# Altium project PCB_Project.PrjPcb
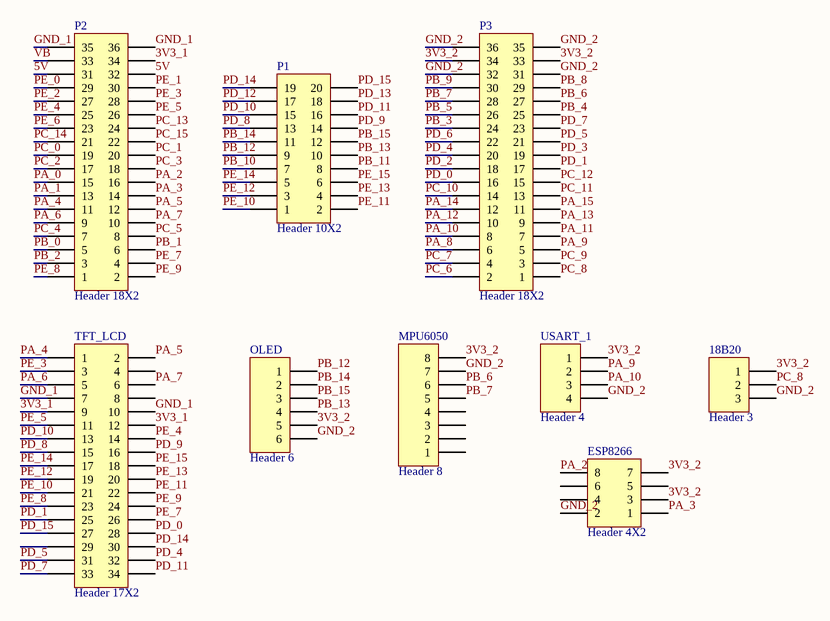
[diagram p0: Sheet1.SchDoc]
1 sheet, 9 parts. Net scope: global (net labels, ports and power ports of the same name join across sheets).
Board file: PCB1.PcbDoc

## Sheet Sheet1.SchDoc
size A3

### Parts
18B20  Header 3  [HDR1X3]
ESP8266  Header 4X2  [HDR2X4]
MPU6050  Header 8  [HDR1X8]
OLED  Header 6  [HDR1X6]
P1  Header 10X2  [HDR2X10]
P2  Header 18X2  [HDR2X18]
P3  Header 18X2  [HDR2X18]
TFT_LCD  Header 17X2  [HDR2X17]
USART_1  Header 4  [HDR1X4]

### Nets
3V3_1: P2.34 TFT_LCD.9 TFT_LCD.12
3V3_2: 18B20.1 ESP8266.3 ESP8266.7 MPU6050.8 OLED.5 P3.33 P3.34 USART_1.1
5V: P2.31 P2.32
GND_1: P2.35 P2.36 TFT_LCD.7 TFT_LCD.10
GND_2: 18B20.3 ESP8266.2 MPU6050.7 OLED.6 P3.31 P3.32 P3.35 P3.36 USART_1.4
PA_0: P2.15
PA_1: P2.13
PA_2: ESP8266.8 P2.16
PA_3: ESP8266.1 P2.14
PA_4: P2.11 TFT_LCD.1
PA_5: P2.12 TFT_LCD.2
PA_6: P2.9 TFT_LCD.5
PA_7: P2.10 TFT_LCD.6
PA_8: P3.6
PA_9: P3.5 USART_1.2
PA_10: P3.8 USART_1.3
PA_11: P3.7
PA_12: P3.10
PA_13: P3.9
PA_14: P3.12
PA_15: P3.11
PB_0: P2.5
PB_1: P2.6
PB_2: P2.3
PB_3: P3.24
PB_4: P3.25
PB_5: P3.26
PB_6: MPU6050.6 P3.27
PB_7: MPU6050.5 P3.28
PB_8: P3.29
PB_9: P3.30
PB_10: P1.7
PB_11: P1.8
PB_12: OLED.1 P1.9
PB_13: OLED.4 P1.10
PB_14: OLED.2 P1.11
PB_15: OLED.3 P1.12
PC_0: P2.19
PC_1: P2.20
PC_2: P2.17
PC_3: P2.18
PC_4: P2.7
PC_5: P2.8
PC_6: P3.2
PC_7: P3.4
PC_8: 18B20.2 P3.1
PC_9: P3.3
PC_10: P3.14
PC_11: P3.13
PC_12: P3.15
PC_13: P2.24
PC_14: P2.21
PC_15: P2.22
PD_0: P3.16 TFT_LCD.28
PD_1: P3.17 TFT_LCD.25
PD_2: P3.18
PD_3: P3.19
PD_4: P3.20 TFT_LCD.32
PD_5: P3.21 TFT_LCD.31
PD_6: P3.22
PD_7: P3.23 TFT_LCD.33
PD_8: P1.13 TFT_LCD.15
PD_9: P1.14 TFT_LCD.16
PD_10: P1.15 TFT_LCD.13
PD_11: P1.16 TFT_LCD.34
PD_12: P1.17
PD_13: P1.18
PD_14: P1.19 TFT_LCD.30
PD_15: P1.20 TFT_LCD.27
PE_0: P2.29
PE_1: P2.30
PE_2: P2.27
PE_3: P2.28 TFT_LCD.3
PE_4: P2.25 TFT_LCD.14
PE_5: P2.26 TFT_LCD.11
PE_6: P2.23
PE_7: P2.4 TFT_LCD.26
PE_8: P2.1 TFT_LCD.23
PE_9: P2.2 TFT_LCD.24
PE_10: P1.1 TFT_LCD.21
PE_11: P1.2 TFT_LCD.22
PE_12: P1.3 TFT_LCD.19
PE_13: P1.4 TFT_LCD.20
PE_14: P1.5 TFT_LCD.17
PE_15: P1.6 TFT_LCD.18
VB: P2.33

Not connected (* = marked no-connect by the designer): ESP8266 4 5 6; MPU6050 1 2 3 4; TFT_LCD 4 8 29

### Library data of the parts
18B20 = Header 3: Header, 3-Pin; LatestRevisionDate: 17-Jul-2002; LatestRevisionNote: Re-released for DXP Platform.; Publisher: Altium Limited
ESP8266 = Header 4X2: Header, 4-Pin, Dual row; LatestRevisionDate: 17-Jul-2002; LatestRevisionNote: Re-released for DXP Platform.; Publisher: Altium Limited
MPU6050 = Header 8: Header, 8-Pin; LatestRevisionDate: 17-Jul-2002; LatestRevisionNote: Re-released for DXP Platform.; Publisher: Altium Limited
OLED = Header 6: Header, 6-Pin; LatestRevisionDate: 17-Jul-2002; LatestRevisionNote: Re-released for DXP Platform.; Publisher: Altium Limited
P1 = Header 10X2: Header, 10-Pin, Dual row; LatestRevisionDate: 17-Jul-2002; LatestRevisionNote: Re-released for DXP Platform.; Publisher: Altium Limited
P2 P3 = Header 18X2: Header, 18-Pin, Dual row; LatestRevisionDate: 17-Jul-2002; LatestRevisionNote: Re-released for DXP Platform.; Publisher: Altium Limited
TFT_LCD = Header 17X2: Header, 17-Pin, Dual row; LatestRevisionDate: 17-Jul-2002; LatestRevisionNote: Re-released for DXP Platform.; Publisher: Altium Limited
USART_1 = Header 4: Header, 4-Pin; LatestRevisionDate: 17-Jul-2002; LatestRevisionNote: Re-released for DXP Platform.; Publisher: Altium Limited